# Altium schematic sheet SpO_Sensor — копия.SchDoc
size 420 x 297 mm
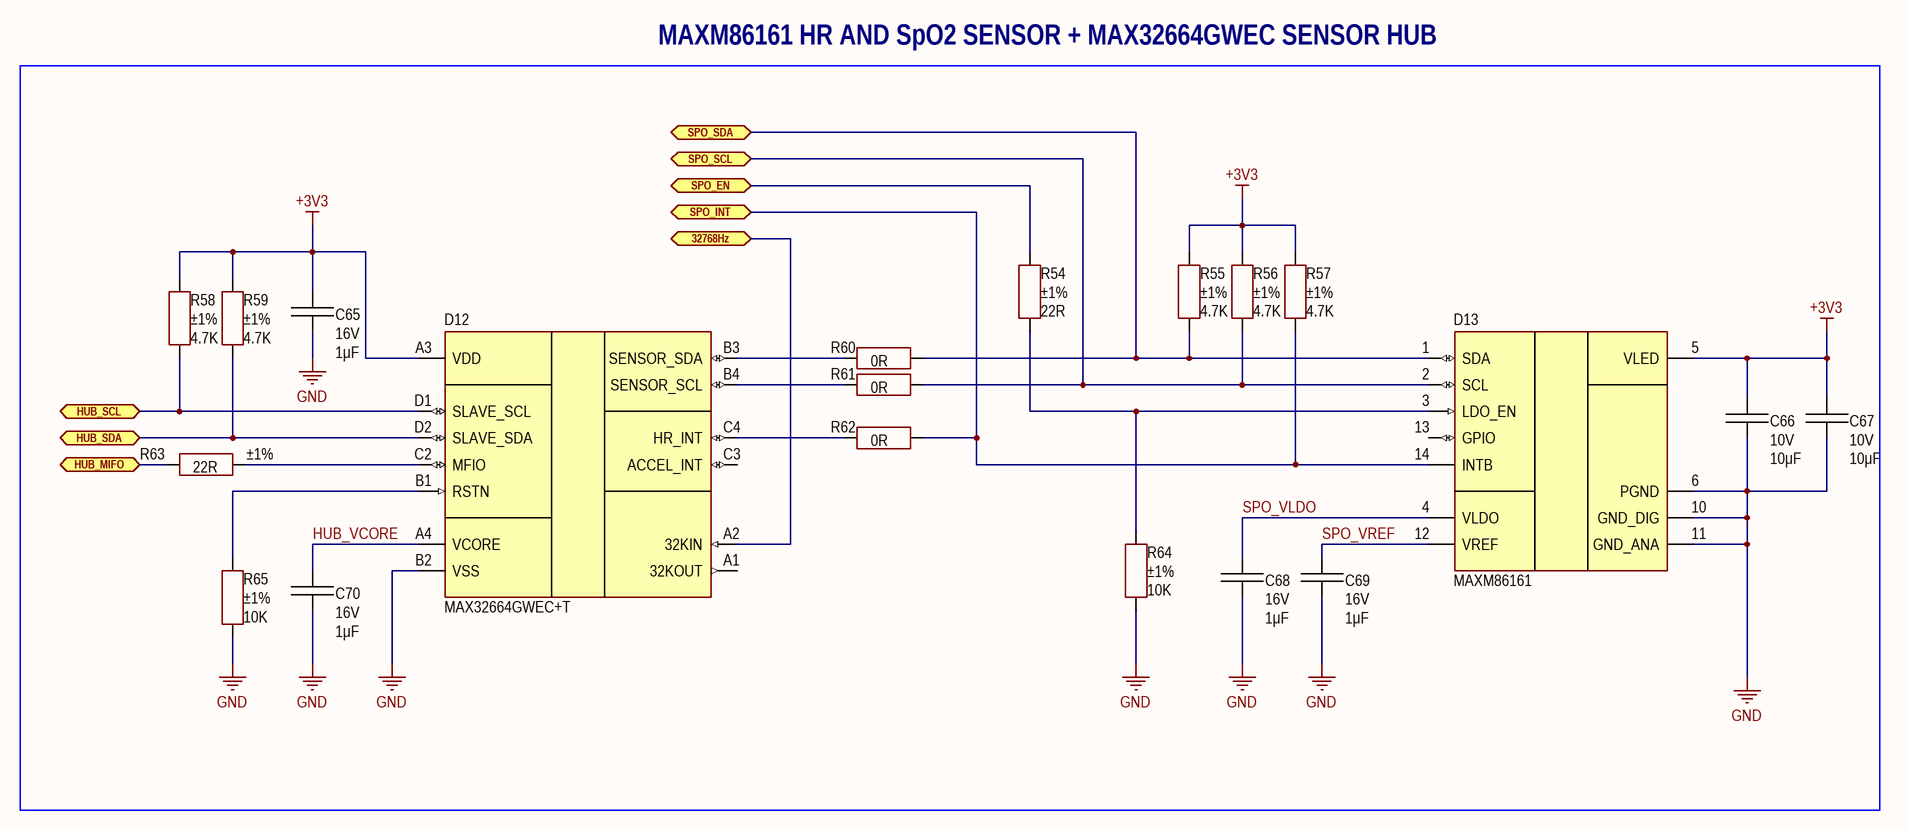
[diagram p0: SpO_Sensor — копия.SchDoc]

## Parts
C65  value 1μF  Voltage: 16V  [CAP: 0805]
C66  value 10μF  Voltage: 10V  [CAP: 0805]
C67  value 10μF  Voltage: 10V  [CAP: 0805]
C68  value 1μF  Voltage: 16V  [CAP: 0805]
C69  value 1μF  Voltage: 16V  [CAP: 0805]
C70  value 1μF  Voltage: 16V  [CAP: 0805]
D12  (no value)  [IC: 16-WLP]
D13  (no value)  [IC: 14-OLGA]
R54  value 22R  Tolerance: ±1%  [RES: 0805]
R55  value 4.7K  Tolerance: ±1%  [RES: 0805]
R56  value 4.7K  Tolerance: ±1%  [RES: 0805]
R57  value 4.7K  Tolerance: ±1%  [RES: 0805]
R58  value 4.7K  Tolerance: ±1%  [RES: 0805]
R59  value 4.7K  Tolerance: ±1%  [RES: 0805]
R60  value 0R  [RES: 0805]
R61  value 0R  [RES: 0805]
R62  value 0R  [RES: 0805]
R63  value 22R  Tolerance: ±1%  [RES: 0805]
R64  value 10K  Tolerance: ±1%  [RES: 0805]
R65  value 10K  Tolerance: ±1%  [RES: 0805]

## Blocks framed on the sheet
MAXM86161 HR AND SpO2 SENSOR + MAX32664GWEC SENSOR HUB: C65-C70 D12 D13 R54-R65

## Ports
32768Hz (bidir), HUB_MIFO (bidir), HUB_SCL (bidir), HUB_SDA (bidir), SPO_EN (bidir), SPO_INT (bidir), SPO_SCL (bidir), SPO_SDA (bidir)

## Nets
+3V3: C65.2 C66.2 C67.2 D12.A3(VDD) D13.5(VLED) R55.1 R56.1 R57.1 R58.1 R59.1
GND: C65.1 C66.1 C67.1 C68.1 C69.1 C70.1 D12.B2(VSS) D13.6(PGND) D13.10(GND_DIG) D13.11(GND_ANA) R64.2 R65.2
32768Hz: D12.A2(32KIN) ; port 32768Hz
HUB_MIFO: R63.1 ; port HUB_MIFO
HUB_SCL: D12.D1(SLAVE_SCL) R58.2 ; port HUB_SCL
HUB_SDA: D12.D2(SLAVE_SDA) R59.2 ; port HUB_SDA
HUB_VCORE: C70.2 D12.A4(VCORE)
SPO_EN: R54.2 ; port SPO_EN
SPO_INT: D13.14(INTB) R57.2 R62.1 ; port SPO_INT
SPO_SCL: D13.2(SCL) R56.2 R61.1 ; port SPO_SCL
SPO_SDA: D13.1(SDA) R55.2 R60.1 ; port SPO_SDA
SPO_VLDO: C68.2 D13.4(VLDO)
SPO_VREF: C69.2 D13.12(VREF)
NetD12_B1: D12.B1(RSTN) R65.1
NetD12_B3: D12.B3(SENSOR_SDA) R60.2
NetD12_B4: D12.B4(SENSOR_SCL) R61.2
NetD12_C2: D12.C2(MFIO) R63.2
NetD12_C4: D12.C4(HR_INT) R62.2
NetD13_3: D13.3(LDO_EN) R54.1 R64.1

Not connected (* = marked no-connect by the designer): D12 A1(32KOUT) C3(ACCEL_INT); D13 13(GPIO)

## Notes on the sheet
- Author
- Manufacturer
- Date
- Page
- Total pages
- Size page
- A3
- Materials

## Library data of the parts
C65 C68-C70 = Ceramic_0805: 1 µF ±10% 16V Ceramic Capacitor X7R 0805 (2012 Metric); Manufacturer: Yageo; PartNumber: CC0805KKX7R7BB105; ValueManufacturerPartNumber: Ceramic capacitor, 1μF, X7R, ±10%, 16V, 0805, -55...+125°C; Package: 0805; HelpURL: https://www.digikey.com/en/products/detail/yageo/CC0805KKX7R7BB105/2103103; Temperature: -55...+125°C; TypeCapacitor: Ceramic capacitor; Tolerance: ±10%; TypeDielectric: X7R
C66 C67 = Ceramic_0805: 10 µF ±10% 10V Ceramic Capacitor X7R 0805 (2012 Metric); Manufacturer: Yageo; PartNumber: CC0805KFX7R6BB106; ValueManufacturerPartNumber: Ceramic capacitor, 10μF, X7R, ±10%, 10V, 0805, -55...+125°C; Package: 0805; HelpURL: https://www.digikey.com/en/products/detail/yageo/CC0805KFX7R6BB106/11611326; Temperature: -55...+125°C; TypeCapacitor: Ceramic capacitor; Tolerance: ±10%; TypeDielectric: X7R
D12 = MAX32664GWEC+T: Sensor Hub; Manufacturer: Maxim Integrated; Supply: 1.71...3.63V; HelpURL: https://www.digikey.com/en/products/detail/maxim-integrated/MAX32664GWEC-T/11485242; Package: 16-WFL; ComponentType: IC Sensor Hub; ValueManufacturerPartNumber: =ComponentType+', '+Sensing+', '+Accuracy+', '+GainBandwidth+', '+Sensitivity+', '+Temperature+', '+Package; Temperature: -40°C..+105°C; Sensing: Sensor Hub; PartNumber: MAX32664GWEC+T
D13 = MAXM86161: HR and SpO2 sensor; Manufacturer: Maxim Integrated; Supply: 3.0...3.3V; HelpURL: https://www.digikey.com/en/products/detail/maxim-integrated/MAXM86161EFD/10258730; Package: 14-OLGA; ComponentType: IC HR and SpO2 sensor; ValueManufacturerPartNumber: =ComponentType+', '+Sensing+', '+Accuracy+', '+GainBandwidth+', '+Sensitivity+', '+Temperature+', '+Package; Temperature: -40°C..+85°C; Sensing: HR and SpO2 sensor; PartNumber: MAXM86161
R54 R63 = Resistor_0805: 22 Ohms ±1% 0.125W, 1/8W Chip Resistor 0805 (2012 Metric) Moisture Resistant Thick Film; Manufacturer: Yageo; PartNumber: RC0805FR-0722RL; ValueManufacturerPartNumber: Resistor film, 22R, ±1%, 0805, 0.125W, -55...+125°C; TypeResistor: Resistor film; Package: 0805; HelpURL: https://www.digikey.com/en/products/detail/yageo/RC0805FR-0722RL/727735; Temperature: -55...+125°C; Power: 0.125W
R55-R59 = Resistor_0805: 4.7 kOhms ±5% 0.125W, 1/8W Chip Resistor 0805 (2012 Metric) Moisture Resistant Thick Film; Manufacturer: Yageo; PartNumber: RC0805JR-074K7L; ValueManufacturerPartNumber: Resistor film, 4.7K, ±1%, 0805, 0.125W, -55...+125°C; TypeResistor: Resistor film; Package: 0805; HelpURL: https://www.digikey.com/en/products/detail/yageo/RC0805JR-074K7L/728327; Temperature: -55...+125°C; Power: 0.125W
R60-R62 = Resistor_0805: 0 Ohms Jumper 0.125W, 1/8W Chip Resistor 0805 (2012 Metric) Moisture Resistant Thick Film; Manufacturer: Yageo; PartNumber: RC0805JR-070RL; ValueManufacturerPartNumber: Resistor film, 0R, , 0805, 0.125W, -55...+125°C; TypeResistor: Resistor film; Package: 0805; HelpURL: https://www.digikey.com/en/products/detail/yageo/RC0805JR-070RL/728216; Temperature: -55...+125°C; Power: 0.125W
R64 R65 = Resistor_0805: 10 kOhms ±1% 0.125W, 1/8W Chip Resistor 0805 (2012 Metric) Moisture Resistant Thick Film; Manufacturer: Yageo; PartNumber: RC0805FR-0710KL; ValueManufacturerPartNumber: Resistor film, 10K, ±1%, 0805, 0.125W, -55...+125°C; TypeResistor: Resistor film; Package: 0805; HelpURL: https://www.digikey.com/en/products/detail/yageo/RC0805FR-0710KL/727535; Temperature: -55...+125°C; Power: 0.125W